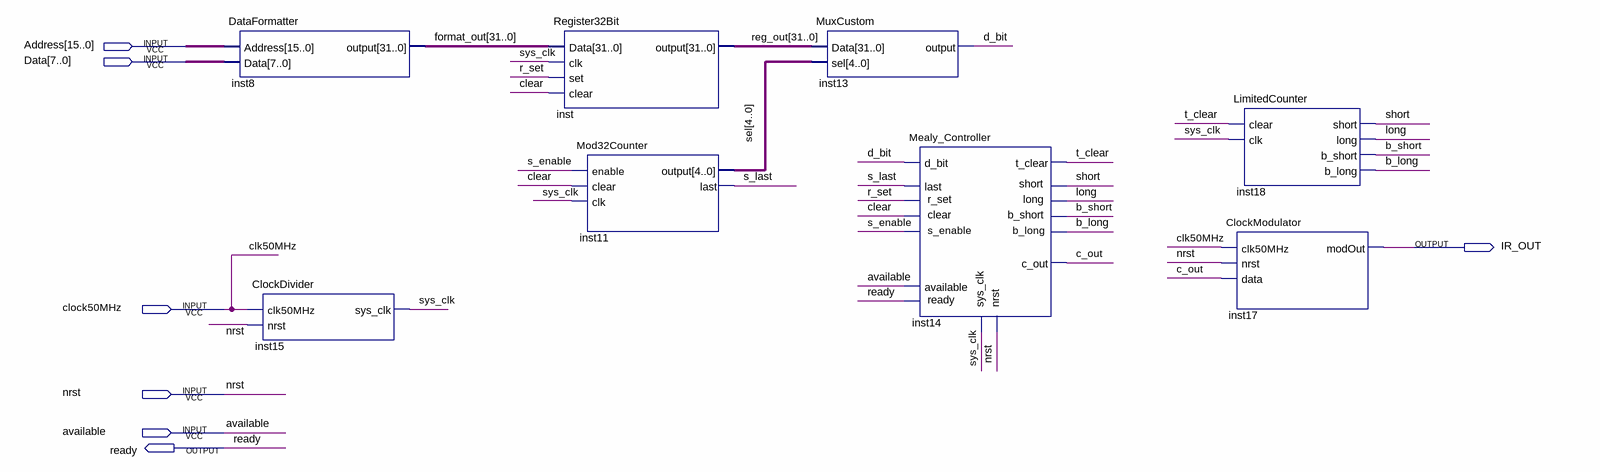
[diagram p0: schematic sheet]
// Quartus schematic NEC_IR_Transmitter.bdf as structural Verilog: 8 symbols, 7 pins
module NEC_IR_Transmitter (
  input  [15:0] Address,
  input  [7:0] Data,
  input  clock50MHz,
  input  nrst,
  input  available,
  output IR_OUT,
  output ready
);

  wire b_long, b_short, c_out, clear, d_bit, long, r_set, s_enable, s_last, short, sys_clk, t_clear;
  wire [4:0] sel;
  wire [31:0] format_out, reg_out;

  DataFormatter inst8 (.Address(Address), .Data(Data), .\output (format_out));
  ClockDivider inst15 (.clk50MHz(clock50MHz), .nrst(nrst), .sys_clk(sys_clk));
  Register32Bit inst (.Data(format_out), .clk(sys_clk), .set(r_set), .clear(clear), .\output (reg_out));
  Mod32Counter inst11 (.enable(s_enable), .clear(clear), .clk(sys_clk), .\output (sel), .last(s_last));
  MuxCustom inst13 (.Data(reg_out), .sel(sel), .\output (d_bit));
  Mealy_Controller inst14 (
    .d_bit(d_bit), .last(s_last), .short(short), .long(long), .b_short(b_short), .b_long(b_long),
    .sys_clk(sys_clk), .nrst(nrst), .available(available), .clear(clear), .s_enable(s_enable), .r_set(r_set),
    .t_clear(t_clear), .c_out(c_out), .ready(ready));
  LimitedCounter inst18 (
    .clear(t_clear), .clk(sys_clk), .short(short), .long(long), .b_short(b_short), .b_long(b_long));
  ClockModulator inst17 (.clk50MHz(clock50MHz), .nrst(nrst), .data(c_out), .modOut(IR_OUT));

  // Other names for the same wires on the sheet: clk50MHz = clock50MHz
endmodule
